# EAGLE design gabemon (EAGLE 6.2)
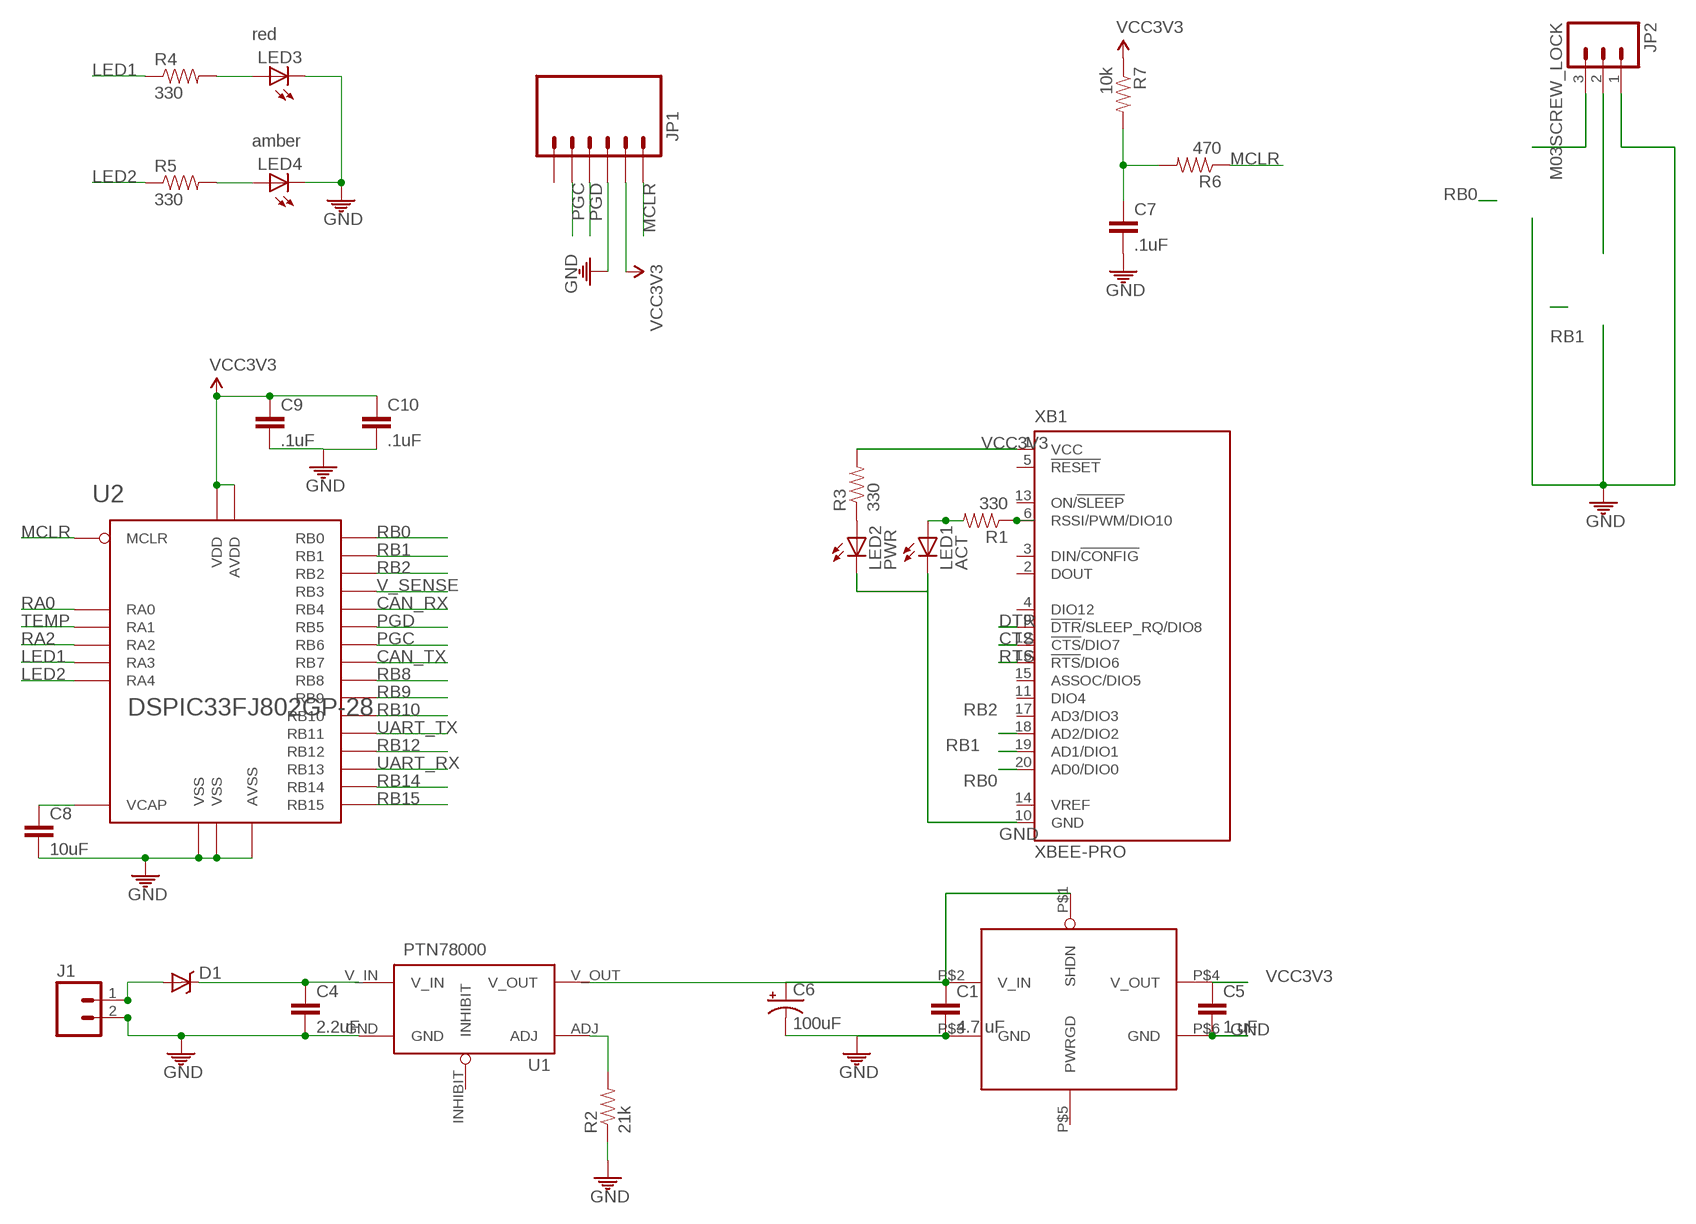
[diagram p0: schematic, sheet 1]

## Parts
C1  4.7 uF  CAP1206  [1206]
C4  2.2uF  CAP1206  [1206]
C5  1 uF  CAP1206  [1206]
C6  100uF  CAP_POL  [CPOL_6.6]
C7  .1uF  CAP1206  [1206]
C8  10uF  CAP1206  [1206]
C9  .1uF  CAP1206  [1206]
C10  .1uF  CAP1206  [1206]
D1  DIODE-SCHOTTKY240A  [SMA-DIODE-B240A]
J1  M023.5MM-NO_SILK  [SCREWTERMINAL-3.5MM-2-NS]
JP1  M06LOCK  [1X06_LOCK]
JP2  M03SCREW_LOCK  [SCREWTERMINAL-3.5MM-3_LOCK.007S]
LED1  ACT  LED1206  [LED-1206]
LED2  PWR  LED1206  [LED-1206]
LED3  LED1206  [LED-1206]
LED4  LED1206  [LED-1206]
R1  330  RESISTOR0805-RES  [0805]
R2  21k  RESISTOR0805-RES  [0805]
R3  330  RESISTOR0805-RES  [0805]
R4  330  RESISTOR0805-RES  [0805]
R5  330  RESISTOR0805-RES  [0805]
R6  470  RESISTOR0805-RES  [0805]
R7  10k  RESISTOR0805-RES  [0805]
U1  PTN78000  PTN78000THROUGH-HOLE  [PTN78000]
U2  DSPIC33FJ802GP-28  [SOIC28-W]
U$2  MCP1826  [SOT223-5]
XB1  XBEE-PRO  [XBEE-PRO]

## Nets
CAN_RX: U2.P$11(RB4)
CAN_TX: U2.P$16(RB7)
CTS: XB1.12(!CTS!/DIO7)
DTR: XB1.9(!DTR!/SLEEP_RQ/DIO8)
GND: C1.2 C4.2 C5.2 C6.- C7.2 C8.2 C9.2 C10.2 J1.2 JP1.3 JP2.1 LED1.C LED2.C LED3.C LED4.C R2.1 U1.GND U2.P$8(VSS) U2.P$19(VSS) U2.P$27(AVSS) U$2.P$3(GND) U$2.P$6(GND) XB1.10(GND)
LED1: R4.1 U2.P$10(RA3)
LED2: R5.1 U2.P$12(RA4)
MCLR: JP1.1 R6.1 U2.P$1(MCLR)
N$1: LED3.A R4.2
N$2: R1.1 XB1.6(RSSI/PWM/DIO10)
N$3: LED4.A R5.2
N$4: LED1.A R1.2
N$5: LED2.A R3.1
N$6 [power]: R2.2 U1.ADJ
N$7: C7.1 R6.2 R7.2
N$8 [power]: C4.1 D1.C U1.V_IN
N$9 [power]: D1.A J1.1
N$10: C8.1 U2.P$20(VCAP)
N$11: JP2.3
N$12: JP2.2
PGC: JP1.5 U2.P$15(RB6)
PGD [small]: JP1.4 U2.P$14(RB5)
RA0: U2.P$2(RA0)
RA2 [small]: U2.P$9(RA2)
RB0 [small]: U2.P$4(RB0) XB1.20(AD0/DIO0)
RB1: U2.P$5(RB1) XB1.19(AD1/DIO1)
RB2 [small]: U2.P$6(RB2) XB1.18(AD2/DIO2)
RB8: U2.P$17(RB8)
RB9: U2.P$18(RB9)
RB10 [small]: U2.P$22(RB10)
RB12: U2.P$23(RB12)
RB14 [small]: U2.P$25(RB14)
RB15 [small]: U2.P$26(RB15)
RTS: XB1.16(!RTS!/DIO6)
TEMP: U2.P$3(RA1)
UART_RX: U2.P$24(RB13)
UART_TX: U2.P$21(RB11)
V_SENSE: U2.P$7(RB3)
VCC: C1.1 C6.+ U1.V_OUT U$2.P$1(SHDN) U$2.P$2(V_IN)
VCC3V3: C5.1 C9.1 C10.1 JP1.2 R3.2 R7.1 U2.P$13(VDD) U2.P$28(AVDD) U$2.P$4(V_OUT) XB1.1(VCC)
Unconnected: JP1.6 U1.INHIBIT U$2.P$5(PWRGD) XB1.2(DOUT) XB1.3(DIN/!CONFIG) XB1.4(DIO12) XB1.5(!RESET) XB1.11(DIO4) XB1.13(ON/!SLEEP) XB1.14(VREF) XB1.15(ASSOC/DIO5) XB1.17(AD3/DIO3)

## Library data of the parts
C1 C5 = ASL:CAP: Capacitor Standard 0603 ceramic capacitor, and 0.1" leaded capacitor.
C4 C7-C10 = CMPE118lib:CAP: Capacitor Standard 0603 ceramic capacitor, and 0.1" leaded capacitor.
C6 = CMPE118lib:CAP_POL: Capacitor Polarized These are standard SMD and PTH capacitors. Normally 10uF, 47uF, and 100uF in electrolytic and tantalum varieties. Always verify the external diameter of the through hole cap, it varies with capacity, voltage, and manufacturer. The EIA devices should be standard.
D1 = CMPE118lib:DIODE-SCHOTTKY
J1 = ASL:M02: Header 2 Standard 2-pin 0.1" header. Use with straight break away headers (SKU : PRT-00116), right angle break away headers (PRT-00553), swiss pins (PRT-00743), machine pins (PRT-00117), and female headers (PRT-00115). Molex polarized connector foot print use with SKU : PRT-08233 with associated crimp pins and housings.
JP1 = CMPE118lib:M06: Header 6 Standard 6-pin 0.1" header. Use with straight break away headers (SKU : PRT-00116), right angle break away headers (PRT-00553), swiss pins (PRT-00743), machine pins (PRT-00117), and female headers (PRT-00115). Molex polarized connector foot print use with SKU : PRT-08094 with associated crimp pins and housings. NOTES ON THE VARIANTS LOCK and LOCK_LONGPADS... This footprint was designed to help hold the alignment of a through-hole component (i.e. 6-pin header) while soldering it into place. You may notice that each hole has been shifted either up or down by 0.005 of an inch from it's more standard position (which is a perfectly straight line). This slight alteration caused the pins (the squares in the middle) to touch the edges of the holes. Because they are alternating, it causes a "brace" to hold the component in place. 0.005 has proven to be the perfect amount of "off-center" position when using our standard breakaway headers. Although looks a little odd when you look at the bare footprint, once you have a header in there, the alteration is very hard to notice. Also, if you push a header all the way into place, it is covered up entirely on the bottom side. This idea of altering the position of holes to aid alignment will be further integrated into the Sparkfun Library for other footprints. It can help hold any component with 3 or more connection pins.
JP2 = ASL:M03: Header 3 Standard 3-pin 0.1" header. Use with straight break away headers (SKU : PRT-00116), right angle break away headers (PRT-00553), swiss pins (PRT-00743), machine pins (PRT-00117), and female headers (PRT-00115). Molex polarized connector foot print use with SKU : PRT-08232 with associated crimp pins and housings.
LED1 LED2 = ASL:LED: LEDs Standard schematic elements and footprints for 5mm, 3mm, 1206, and 0603 sized LEDs. 5mm - Spark Fun Electronics SKU : COM-00529 (and others)
LED3 = CMPE118lib:LED: LEDs Standard schematic elements and footprints for 5mm, 3mm, 1206, and 0603 sized LEDs. 5mm - Spark Fun Electronics SKU : COM-00529 (and others); COLOR: red
LED4 = CMPE118lib:LED: LEDs Standard schematic elements and footprints for 5mm, 3mm, 1206, and 0603 sized LEDs. 5mm - Spark Fun Electronics SKU : COM-00529 (and others); COLOR: amber
R1 R3 = ASL:RESISTOR: Resistor Basic schematic elements and footprints for 0603, 1206, and PTH resistors.
R2 R4-R7 = CMPE118lib:RESISTOR: Resistor Basic schematic elements and footprints for 0603, 1206, and PTH resistors.
U1 = ASL:PTN78000: This is the PTN78000 part by Texas Instruments. It's a 1.5A adjustable switching regulator.
U2 = CMPE118lib:DSPIC33FJ*802GP-28: dspic33fj*802gp 28pin
U$2 = ASL:MCP1826
XB1 = xbee:XBEE: XBee (TM) /XBee-PRO(TM) OEM RF Modules Source: MaxStream, Inc. xbee_productmanual.pdf; MPN: XBP24-AWI-001; OC_FARNELL: 1337916; OC_NEWARK: 42M2667

## Net classes
1 power: width 1.27 mm, clearance 0.508 mm to class 0
2 small: width 0.254 mm, clearance 0.254 mm to class 1

## Board
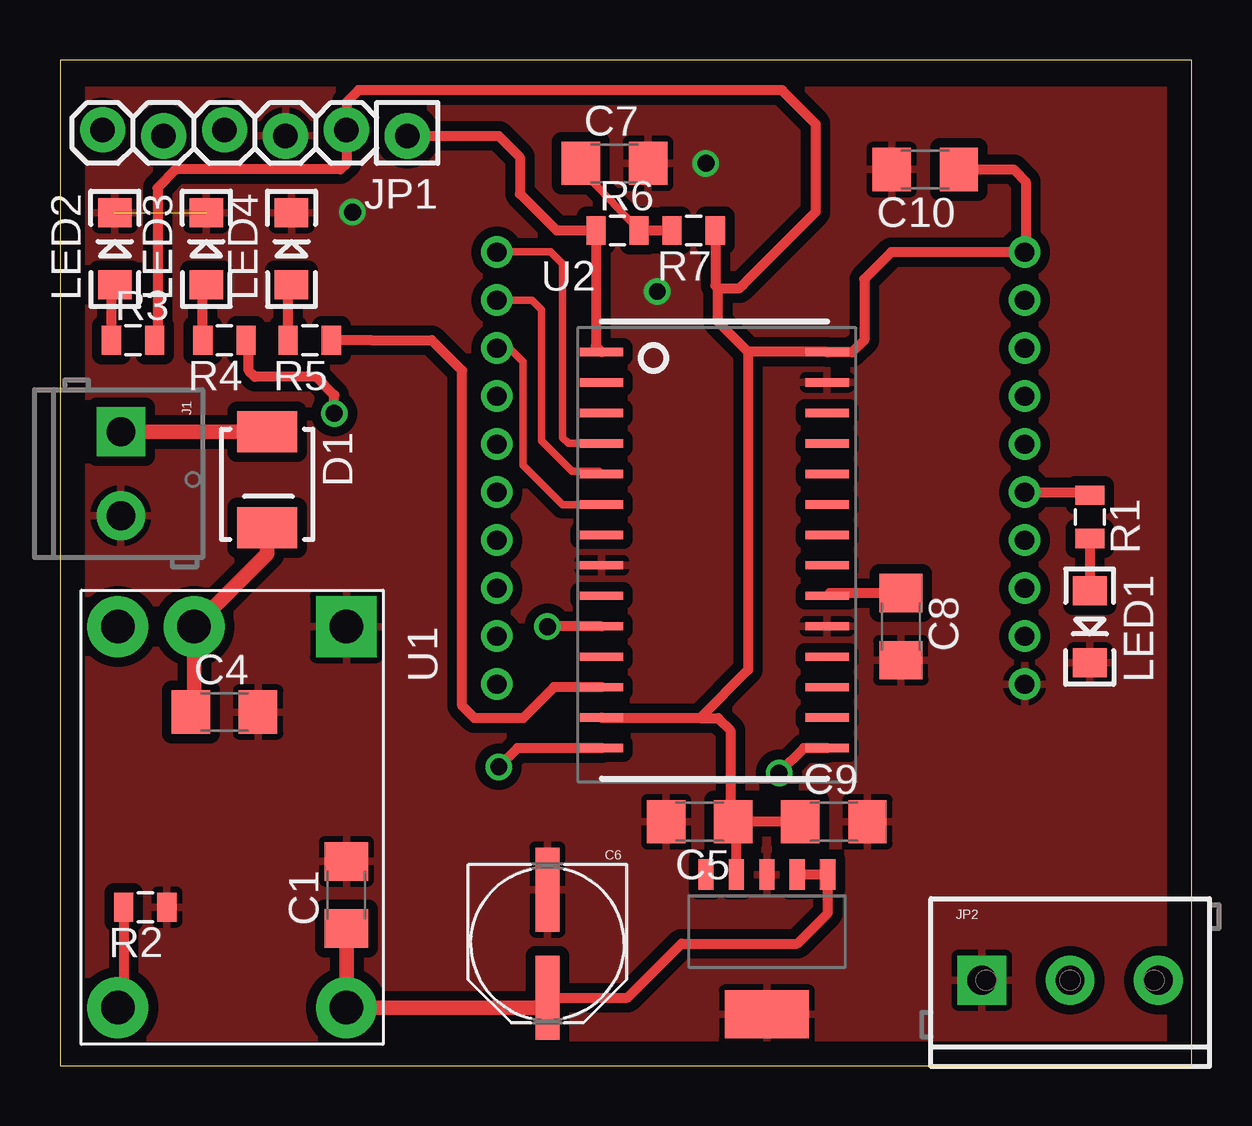
[diagram p1: board, top side]
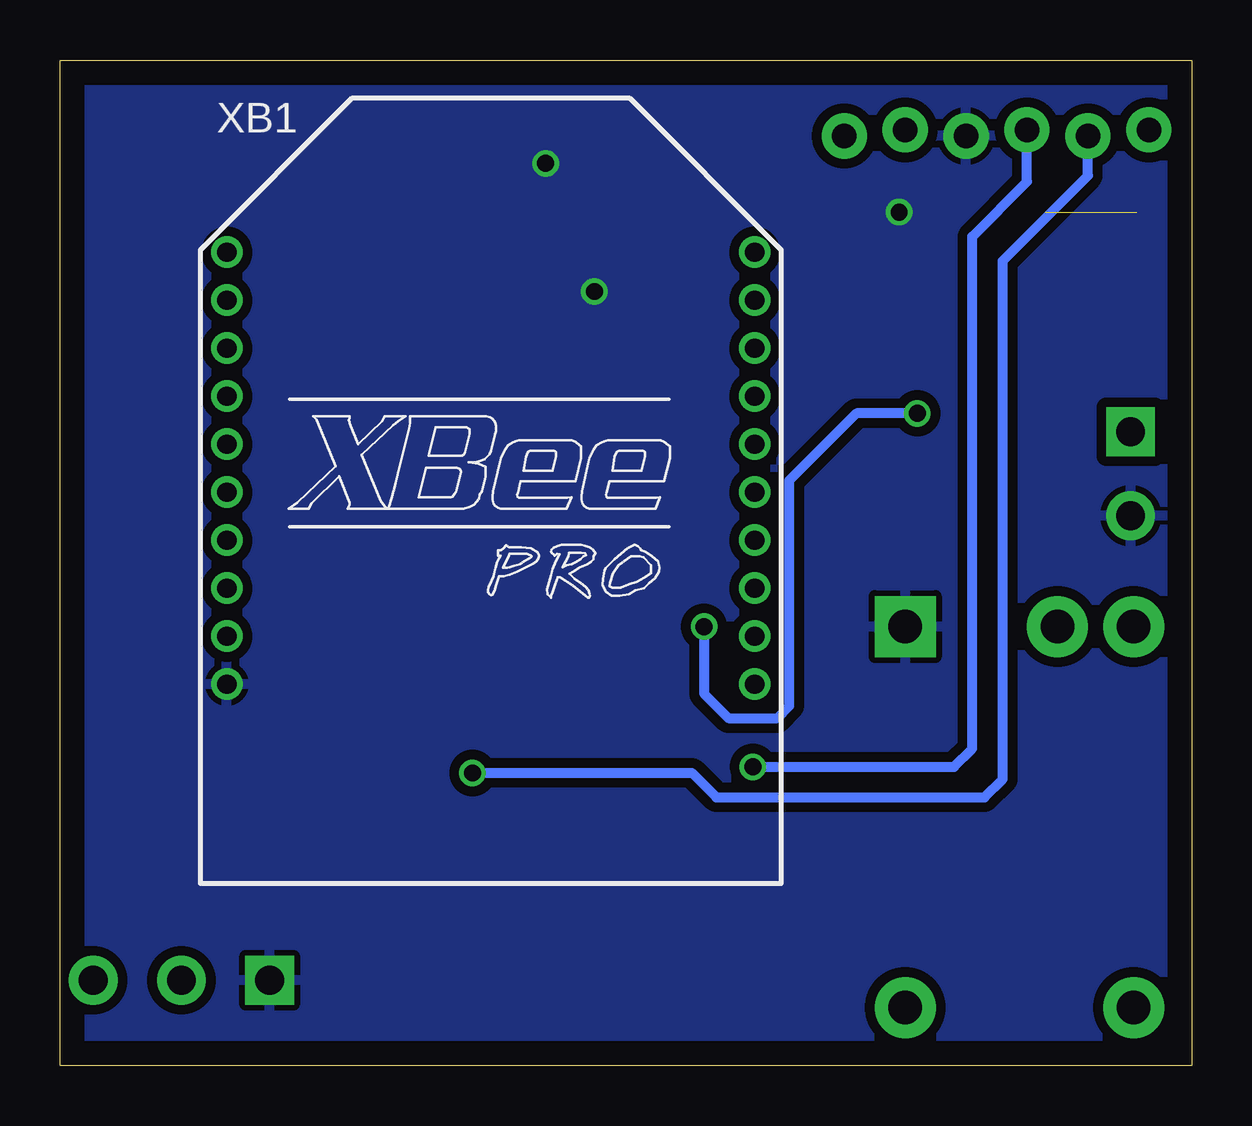
[diagram p2: board, bottom side, seen from below]

Size 47.17 x 41.9 mm. Coordinates in mm from the lower left corner, seen from the top.
Outline: 0,0 47.17,0 47.17,41.9 0,41.9 0,0
Copper layers (1*16): Top 0.035mm / dielectric 1.5mm / Bottom 0.035mm
Design rules: minimum track width 10mil, minimum drill 24mil, track to track 8mil, track to pad 8mil, pad to pad 8mil, via to via 8mil, smd to smd 8mil, copper to edge 40mil, drill to drill 8mil, minimum pad ring 10mil, minimum via ring 8mil, stop-mask expansion 4mil, vias tented up to drill 0mil, thermal gap 10mil

### Footprints (pad centres in the part's own frame; a part is rotated, then mirrored left to right if it is on the bottom)
1206 = smd 1.6 x 1.8: 1 -1.4,0; 2 1.4,0
CPOL_6.6 = smd 1 x 3.5: + 0,2.25; - 0,-2.25
SMA-DIODE-B240A = smd 1.7 x 2.5: A 0,0; C 4,0
SCREWTERMINAL-3.5MM-2-NS = drill 1.2 pad 2.032 square: 1 0,0 | drill 1.2 pad 2.032: 2 3.5,0
1X06_LOCK = drill 1.016 pad 1.88: 1 0,0.127; 2 2.54,-0.127; 3 5.08,0.127; 4 7.62,-0.127; 5 10.16,0.127; 6 12.7,-0.127
SCREWTERMINAL-3.5MM-3_LOCK.007S = drill 1.2 pad 2.032 square: 1 -0.178,0 | drill 1.2 pad 2.032: 2 3.5,0; 3 7.178,0
LED-1206 = smd 1.2 x 1.4: A -1.5,0; C 1.5,0
0805 = smd 0.8 x 1.2: 1 -0.9,0; 2 0.9,0
PTN78000 = drill 1.397 pad 2.54: ADJ 15.875,-9.525; INHIBIT 0,-9.525; V_IN 0,-6.35; V_OUT 15.875,0 | drill 1.397 pad 2.54 square: GND 0,0
SOIC28-W = smd 1.8 x 0.35: P$1 -4.6,8.4; P$2 -4.6,7.13; P$3 -4.6,5.86; P$4 -4.6,4.59; P$5 -4.6,3.32; P$6 -4.6,2.05; P$7 -4.6,0.78; P$8 -4.6,-0.49; P$9 -4.6,-1.76; P$10 -4.6,-3.03; P$11 -4.6,-4.3; P$12 -4.6,-5.57; P$13 -4.6,-6.84; P$14 -4.6,-8.11; P$15 4.8,-8.11; P$16 4.8,-6.84; P$17 4.8,-5.57; P$18 4.8,-4.3; P$19 4.8,-3.03; P$20 4.8,-1.76; P$21 4.8,-0.49; P$22 4.8,0.78; P$23 4.8,2.05; P$24 4.8,3.32; P$25 4.8,4.59; P$26 4.8,5.86; P$27 4.8,7.13; P$28 4.8,8.4
SOT223-5 = smd 0.635 x 1.27: P$1 -2.54,-2.625; P$2 -1.27,-2.625; P$3 0,-2.625; P$4 1.27,-2.625; P$5 2.54,-2.625 | smd 3.5 x 2: P$6 0,3.2
XBEE-PRO = drill 0.8 pad 1.27: 1 -11,9; 2 -11,7; 3 -11,5; 4 -11,3; 5 -11,1; 6 -11,-1; 7 -11,-3; 8 -11,-5; 9 -11,-7; 10 -11,-9; 11 11,-9; 12 11,-7; 13 11,-5; 14 11,-3; 15 11,-1; 16 11,1; 17 11,3; 18 11,5; 19 11,7; 20 11,9

### Placement (x,y rotation side)
C1  11.94,7.11 90 top
C4  6.86,14.73 0 top
C5  26.67,10.16 180 top
C6  20.32,5.08 180 top
C7  23.11,37.59 0 top
C8  35.05,18.29 270 top
C9  32.26,10.16 0 top
C10  36.07,37.34 180 top
D1  8.64,26.42 270 top
J1  2.54,26.42 270 top
JP1  14.48,38.86 180 top
JP2  38.61,3.56 0 top
LED1  42.93,18.29 270 top
LED2  2.29,34.04 90 top
LED3  6.1,34.04 90 top
LED4  9.65,34.04 90 top
R1  42.93,22.86 270 top
R2  3.56,6.6 180 top
R3  3.05,30.23 0 top
R4  6.86,30.23 180 top
R5  10.41,30.23 180 top
R6  23.24,34.8 0 top
R7  26.42,34.8 180 top
U1  11.94,18.29 270 top
U2  27.18,21.34 0 top
U$2  29.46,5.33 180 top
XB1  29.21,24.89 0 bottom

### Tracks (layer width: path | path; a pad name or v marks a point on that pad's centre or on a via)
GND  (via drill 0.7)  (1 unrouted)
  other vias: 26.92,37.59 24.89,32.26 12.19,35.56
  pour Bottom (isolate 0.406): 0.51,40.64 46.99,40.64 46.99,0.25 0.51,0.25
  pour Top (isolate 0.406): 0.51,40.64 46.99,40.64 46.99,0.25 0.51,0.25
LED1  (via drill 0.7)
  Top 0.305: 20.34,18.31 v20.32,18.29
  Top 0.406: U2.P$10 20.34,18.31 | v11.43,27.18 11.43,27.94 10.67,28.7 8.13,28.7 7.87,28.96 7.87,30.11 R4.1
  Bottom 0.406: v20.32,18.29 20.32,15.49 19.3,14.48 17.27,14.48 16.76,14.99 16.76,24.38 13.97,27.18 v11.43,27.18
LED2
  Top 0.406: U2.P$12 20.59,15.77 19.3,14.48 17.27,14.48 16.76,14.99 16.76,28.96 15.49,30.23 12.95,30.23 R5.1
MCLR
  Top 0.305: 22.1,35.04 R6.1
  Top 0.406: U2.P$1 22.34,29.97 R6.1 20.7,34.8 19.18,36.32 19.18,37.85 18.29,38.73 JP1.1
N$1
  Top 0.406: R4.2 5.96,32.4 LED3.A
N$2
  Top 0.406: XB1.6 42.79,23.89 R1.1
N$3
  Top 0.406: R5.2 9.51,32.4 LED4.A
N$4
  Top 0.406: R1.2 LED1.A
N$5
  Top 0.406: R3.1 2.15,32.4 LED2.A
N$6
  Top 0.406: R2.2 2.66,2.66 U1.ADJ
N$7
  Top 0.305: R6.2 21.6,37.48 C7.1
  Top 0.406: R6.2 R7.2
N$8
  Top 0.61: D1.C 8.64,21.34 U1.V_IN 5.59,14.86 C4.1
N$9
  Top 0.61: J1.1 D1.A
N$10
  Top 0.305: 32.09,19.69 U2.P$20
  Top 0.406: C8.1 32.09,19.69
N$11
  Top 0.61: 45.72,3.62 JP2.3
N$12
  Top 0.61: 42.16,3.61 JP2.2
PGC  (via drill 0.7)
  Top 0.406: U2.P$15 31.01,13.23 v29.97,12.19
  Bottom 0.406: v29.97,12.19 20.83,12.19 19.81,11.18 8.64,11.18 7.87,11.94 7.87,33.53 4.32,37.08 JP1.5
PGD  (via drill 0.7)
  Top 0.406: U2.P$14 19.07,13.23 v18.29,12.45
  Bottom 0.406: JP1.4 6.86,36.83 9.14,34.54 9.14,13.21 9.91,12.45 v18.29,12.45
RB0
  Top 0.305: 22.6,25.91 U2.P$4 21.19,25.93 20.95,26.16 20.95,33.4 20.45,33.91 18.23,33.91 XB1.20
RB1
  Top 0.305: 22.6,24.64 U2.P$5 22.47,24.77 21.34,24.77 20.07,26.04 20.07,31.5 19.67,31.89 XB1.19
RB2
  Top 0.305: XB1.18 18.75,29.89 19.3,29.34 19.3,25.02 20.95,23.37 22.56,23.37 U2.P$6
VCC
  Top 0.406: U$2.P$2 U$2.P$1 32,6.35 30.73,5.08 25.91,5.08 23.66,2.83 C6.+
  Top 0.61: C1.1 U1.V_OUT 19.9,2.41 C6.+
VCC3V3
  Top 0.406: XB1.1 34.65,33.89 33.53,32.77 33.53,30.23 33.02,29.72 32,29.72 U2.P$28 28.68,29.74 | 40.01,34.09 XB1.1 | 28.68,29.74 27.43,30.99 27.43,32.4 | 28.68,29.74 28.68,16.49 26.67,14.48 | 26.67,14.48 22.6,14.48 U2.P$13 | 26.67,14.48 27.43,14.48 27.94,13.97 27.94,10.29 C5.1 | U$2.P$4 28.19,10.04 C5.1 | C9.1 C5.1 | R3.2 4.06,30.34 4.06,36.58 4.83,37.34 11.68,37.34 11.94,37.59 JP1.2 11.94,40.13 12.45,40.64 30.1,40.64 31.5,39.24 31.5,35.56 28.45,32.51 28.33,32.4 27.43,32.4 | R7.1 27.32,32.51 27.43,32.4 | C10.1 39.75,37.34 40.26,36.83 40.26,33.94 XB1.1